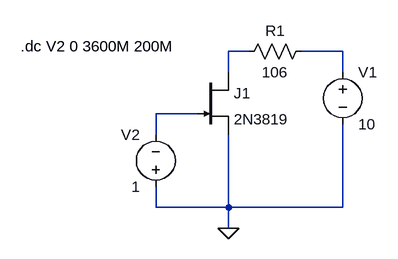
[diagram p0: schematic schemat3.asc]
schemat3.asc, the LTspice schematic file:
Version 4
SHEET 1 880 680
WIRE 176 48 144 48
WIRE 320 48 256 48
WIRE 144 80 144 48
WIRE 320 80 320 48
WIRE 96 144 32 144
WIRE 32 176 32 144
WIRE 32 288 32 256
WIRE 144 288 144 176
WIRE 144 288 32 288
WIRE 320 288 320 160
WIRE 320 288 144 288
WIRE 144 320 144 288
FLAG 144 320 0
SYMBOL voltage 320 64 R0
WINDOW 123 0 0 Left 2
WINDOW 39 0 0 Left 2
SYMATTR InstName V1
SYMATTR Value 10
SYMBOL voltage 32 272 R180
WINDOW 0 24 96 Left 2
WINDOW 3 24 16 Left 2
WINDOW 123 0 0 Left 2
WINDOW 39 0 0 Left 2
SYMATTR InstName V2
SYMATTR Value 1
SYMBOL res 160 64 R270
WINDOW 0 32 56 VTop 2
WINDOW 3 0 56 VBottom 2
SYMATTR InstName R1
SYMATTR Value 106
SYMBOL njf 96 80 R0
SYMATTR InstName J1
SYMATTR Value 2N3819
TEXT -176 40 Left 2 !.dc V2 0 3600M 200M

The netlist it stands for:
* schemat3.asc
V1 N002 0 10
V2 0 N003 1
R1 N001 N002 106
J1 N001 N003 0 2N3819
.model NJF NJF
.model PJF PJF
.lib standard.jft
.dc V2 0 3600M 200M
.backanno
.end